# Altium schematic sheet SD1516.SchDoc
size A4
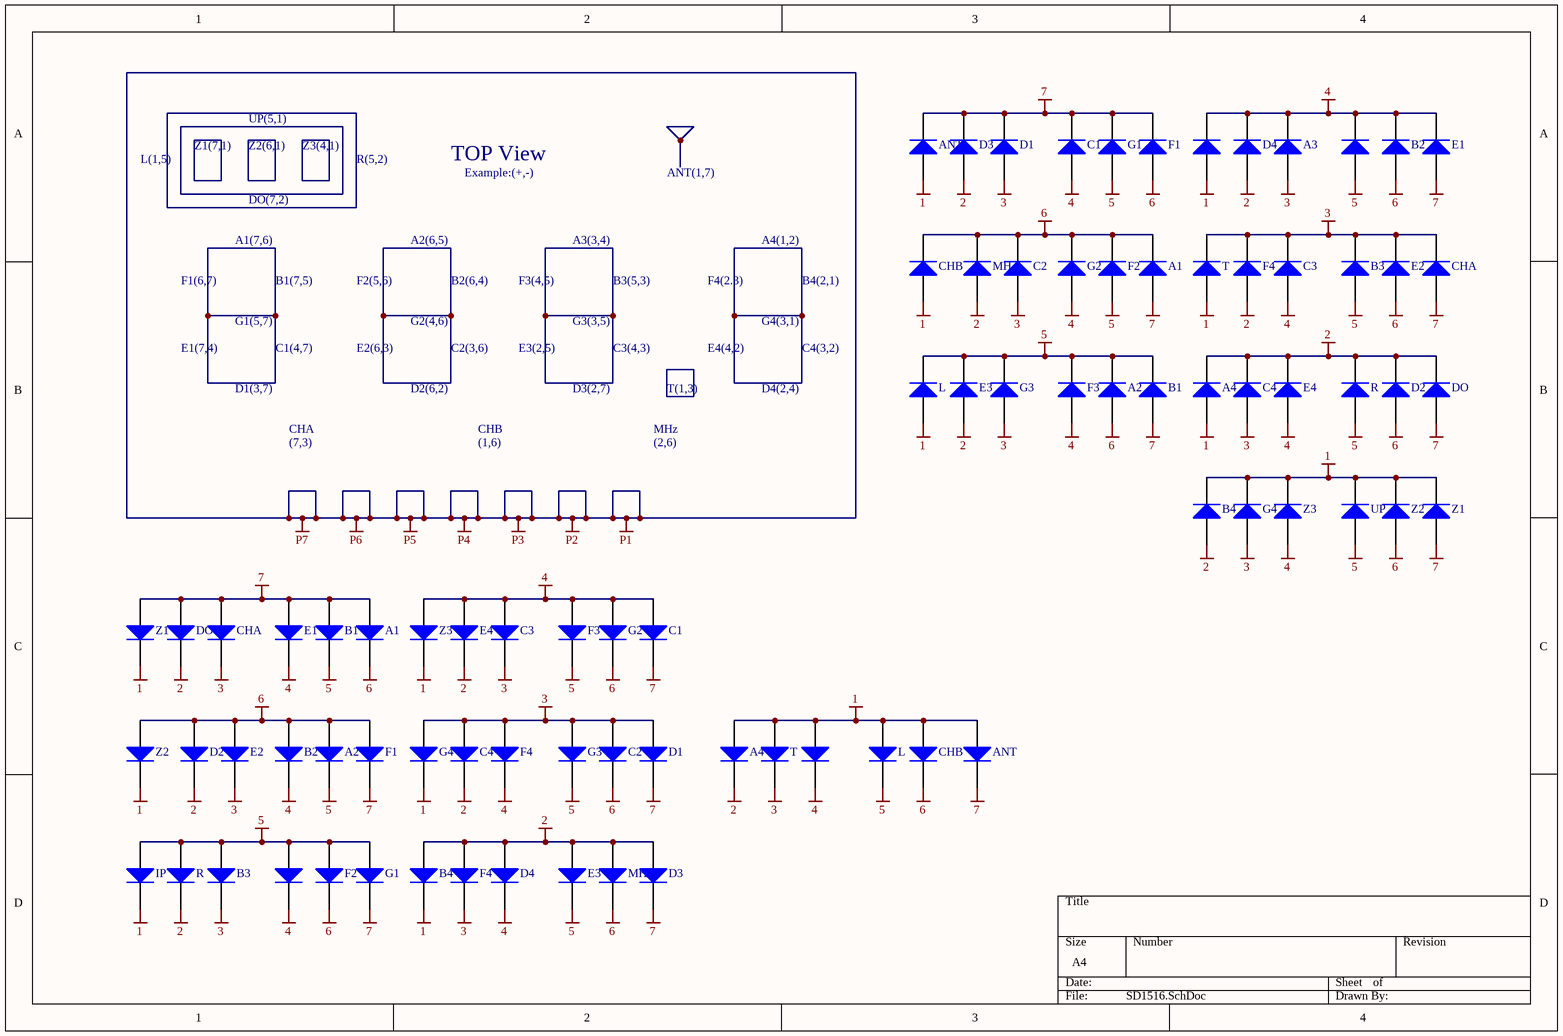
[diagram p0: SD1516.SchDoc]

## Parts
(Parts that share a designator on the sheet are numbered #1, #2 ... from top to bottom, then left to right.)
?#1  ?  [SMC]  (value not drawn)
?#2  (no value)  [SMC]
?#3  ?  [SMC]  (value not drawn)
?#4  ?  [SMC]  (value not drawn)
A1#1  (no value)  [SMC]
A1#2  ?  [SMC]  (value not drawn)
A2#1  (no value)  [SMC]
A2#2  ?  [SMC]  (value not drawn)
A3  (no value)  [SMC]
A4#1  ?  [SMC]  (value not drawn)
A4#2  ?  [SMC]  (value not drawn)
ANT#1  ?  [SMC]  (value not drawn)
ANT#2  ?  [SMC]  (value not drawn)
B1#1  (no value)  [SMC]
B1#2  ?  [SMC]  (value not drawn)
B2#1  (no value)  [SMC]
B2#2  ?  [SMC]  (value not drawn)
B3#1  (no value)  [SMC]
B3#2  ?  [SMC]  (value not drawn)
B4#1  ?  [SMC]  (value not drawn)
B4#2  ?  [SMC]  (value not drawn)
C1#1  (no value)  [SMC]
C1#2  ?  [SMC]  (value not drawn)
C2#1  (no value)  [SMC]
C2#2  ?  [SMC]  (value not drawn)
C3#1  (no value)  [SMC]
C3#2  ?  [SMC]  (value not drawn)
C4#1  (no value)  [SMC]
C4#2  ?  [SMC]  (value not drawn)
CHA#1  (no value)  [SMC]
CHA#2  ?  [SMC]  (value not drawn)
CHB#1  ?  [SMC]  (value not drawn)
CHB#2  ?  [SMC]  (value not drawn)
D1#1  (no value)  [SMC]
D1#2  ?  [SMC]  (value not drawn)
D2#1  (no value)  [SMC]
D2#2  ?  [SMC]  (value not drawn)
D3#1  (no value)  [SMC]
D3#2  ?  [SMC]  (value not drawn)
D4#1  (no value)  [SMC]
D4#2  ?  [SMC]  (value not drawn)
DO#1  (no value)  [SMC]
DO#2  ?  [SMC]  (value not drawn)
E1#1  (no value)  [SMC]
E1#2  ?  [SMC]  (value not drawn)
E2#1  (no value)  [SMC]
E2#2  ?  [SMC]  (value not drawn)
E3#1  (no value)  [SMC]
E3#2  ?  [SMC]  (value not drawn)
E4#1  (no value)  [SMC]
E4#2  ?  [SMC]  (value not drawn)
F1#1  (no value)  [SMC]
F1#2  ?  [SMC]  (value not drawn)
F2#1  (no value)  [SMC]
F2#2  ?  [SMC]  (value not drawn)
F3#1  (no value)  [SMC]
F3#2  ?  [SMC]  (value not drawn)
F4#1  (no value)  [SMC]
F4#2  ?  [SMC]  (value not drawn)
F4#3  ?  [SMC]  (value not drawn)
G1#1  (no value)  [SMC]
G1#2  ?  [SMC]  (value not drawn)
G2#1  (no value)  [SMC]
G2#2  ?  [SMC]  (value not drawn)
G3#1  (no value)  [SMC]
G3#2  ?  [SMC]  (value not drawn)
G4#1  (no value)  [SMC]
G4#2  ?  [SMC]  (value not drawn)
IP  ?  [SMC]  (value not drawn)
L#1  ?  [SMC]  (value not drawn)
L#2  ?  [SMC]  (value not drawn)
MH#1  (no value)  [SMC]
MH#2  ?  [SMC]  (value not drawn)
R#1  (no value)  [SMC]
R#2  ?  [SMC]  (value not drawn)
T#1  ?  [SMC]  (value not drawn)
T#2  ?  [SMC]  (value not drawn)
UP  (no value)  [SMC]
Z1#1  (no value)  [SMC]
Z1#2  ?  [SMC]  (value not drawn)
Z2#1  (no value)  [SMC]
Z2#2  ?  [SMC]  (value not drawn)
Z3#1  (no value)  [SMC]
Z3#2  ?  [SMC]  (value not drawn)

## Nets
1: ?#1.1(A) ?#3.1(A) A4#1.1(A) A4#2.1(A) ANT#1.1(A) ANT#2.1(A) B4#1.2(K) B4#2.2(K) CHB#1.1(A) CHB#2.1(A) G4#1.2(K) G4#2.2(K) IP.2(K) L#1.1(A) L#2.1(A) T#1.1(A) T#2.1(A) UP.2(K) Z1#1.2(K) Z1#2.2(K) Z2#1.2(K) Z2#2.2(K) Z3#1.2(K) Z3#2.2(K)
2: A4#1.2(K) A4#2.2(K) B4#1.1(A) B4#2.1(A) C4#1.2(K) C4#2.2(K) D2#1.2(K) D2#2.2(K) D3#1.1(A) D3#2.1(A) D4#1.1(A) D4#2.1(A) DO#1.2(K) DO#2.2(K) E3#1.1(A) E3#2.1(A) E4#1.2(K) E4#2.2(K) F4#1.1(A) F4#3.1(A) MH#1.1(A) MH#2.1(A) R#1.2(K) R#2.2(K)
3: A3.1(A) B3#1.2(K) B3#2.2(K) C2#1.1(A) C2#2.1(A) C3#1.2(K) C3#2.2(K) C4#1.1(A) C4#2.1(A) CHA#1.2(K) CHA#2.2(K) D1#1.1(A) D1#2.1(A) E2#1.2(K) E2#2.2(K) F4#1.2(K) F4#2.1(A) F4#3.2(K) G3#1.1(A) G3#2.1(A) G4#1.1(A) G4#2.1(A) T#1.2(K) T#2.2(K)
4: ?#1.2(K) ?#2.2(K) ?#3.2(K) ?#4.2(K) A3.2(K) B2#1.2(K) B2#2.2(K) C1#1.1(A) C1#2.1(A) C3#1.1(A) C3#2.1(A) D4#1.2(K) D4#2.2(K) E1#1.2(K) E1#2.2(K) E4#1.1(A) E4#2.1(A) F3#1.1(A) F3#2.1(A) F4#2.2(K) G2#1.1(A) G2#2.1(A) Z3#1.1(A) Z3#2.1(A)
5: ?#2.1(A) ?#4.1(A) A2#1.2(K) A2#2.2(K) B1#1.2(K) B1#2.2(K) B3#1.1(A) B3#2.1(A) E3#1.2(K) E3#2.2(K) F2#1.1(A) F2#2.1(A) F3#1.2(K) F3#2.2(K) G1#1.1(A) G1#2.1(A) G3#1.2(K) G3#2.2(K) IP.1(A) L#1.2(K) L#2.2(K) R#1.1(A) R#2.1(A) UP.1(A)
6: A1#1.2(K) A1#2.2(K) A2#1.1(A) A2#2.1(A) B2#1.1(A) B2#2.1(A) C2#1.2(K) C2#2.2(K) CHB#1.2(K) CHB#2.2(K) D2#1.1(A) D2#2.1(A) E2#1.1(A) E2#2.1(A) F1#1.1(A) F1#2.1(A) F2#1.2(K) F2#2.2(K) G2#1.2(K) G2#2.2(K) MH#1.2(K) MH#2.2(K) Z2#1.1(A) Z2#2.1(A)
7: A1#1.1(A) A1#2.1(A) ANT#1.2(K) ANT#2.2(K) B1#1.1(A) B1#2.1(A) C1#1.2(K) C1#2.2(K) CHA#1.1(A) CHA#2.1(A) D1#1.2(K) D1#2.2(K) D3#1.2(K) D3#2.2(K) DO#1.1(A) DO#2.1(A) E1#1.1(A) E1#2.1(A) F1#1.2(K) F1#2.2(K) G1#1.2(K) G1#2.2(K) Z1#1.1(A) Z1#2.1(A)

## Notes on the sheet
- L(1,5)
- Z1(7,1)
- Z2(6,1)
- UP(5,1)
- Z3(4,1)
- R(5,2)
- TOP View
- Example:(+,-)
- ANT(1,7)
- A1(7,6)
- DO(7,2)
- A2(6,5)
- A3(3,4)
- A4(1,2)
- F1(6,7)
- B1(7,5)
- F2(5,6)
- B2(6,4)
- F3(4,5)
- B3(5,3)
- F4(2.3)
- B4(2,1)
- E1(7,4)
- G1(5,7)
- C1(4,7)
- E2(6,3)
- G2(4,6)
- C2(3,6)
- E3(2,5)
- G3(3,5)
- C3(4,3)
- E4(4,2)
- G4(3,1)
- C4(3,2)
- D1(3,7)
- CHA
- (7,3)
- D2(6,2)
- CHB
- (1,6)
- D3(2,7)
- MHz
- (2,6)
- T(1,3)
- D4(2,4)

## Library data of the parts
?#1-?#4 A1#1 A1#2 A2#1 A2#2 A3 A4#1 A4#2 ANT#1 ANT#2 B1#1 B1#2 B2#1 B2#2 B3#1 B3#2 B4#1 B4#2 C1#1 C1#2 C2#1 C2#2 C3#1 C3#2 C4#1 C4#2 CHA#1 CHA#2 CHB#1 CHB#2 D1#1 D1#2 D2#1 D2#2 D3#1 D3#2 D4#1 D4#2 DO#1 DO#2 E1#1 E1#2 E2#1 E2#2 E3#1 E3#2 E4#1 E4#2 F1#1 F1#2 F2#1 F2#2 F3#1 F3#2 F4#1-F4#3 G1#1 G1#2 G2#1 G2#2 G3#1 G3#2 G4#1 G4#2 IP L#1 L#2 MH#1 MH#2 R#1 R#2 T#1 T#2 UP Z1#1 Z1#2 Z2#1 Z2#2 Z3#1 Z3#2 = Diode: Default Diode; Published: 8-Jun-2000; LatestRevisionDate: 17-Jul-2002; LatestRevisionNote: Re-released for DXP Platform.; PackageVersion: Sep-1996; PackageReference: SMC; Publisher: Altium Limited; PackageDescription: DO-214-AB/SMC; 2 C-Bend Leads; Body 7.9 x 5.9 mm, inc. leads (LxW); Code_JEDEC: DO-214-AB